# Altium schematic sheet motorBoardSCH.SchDoc
size A3
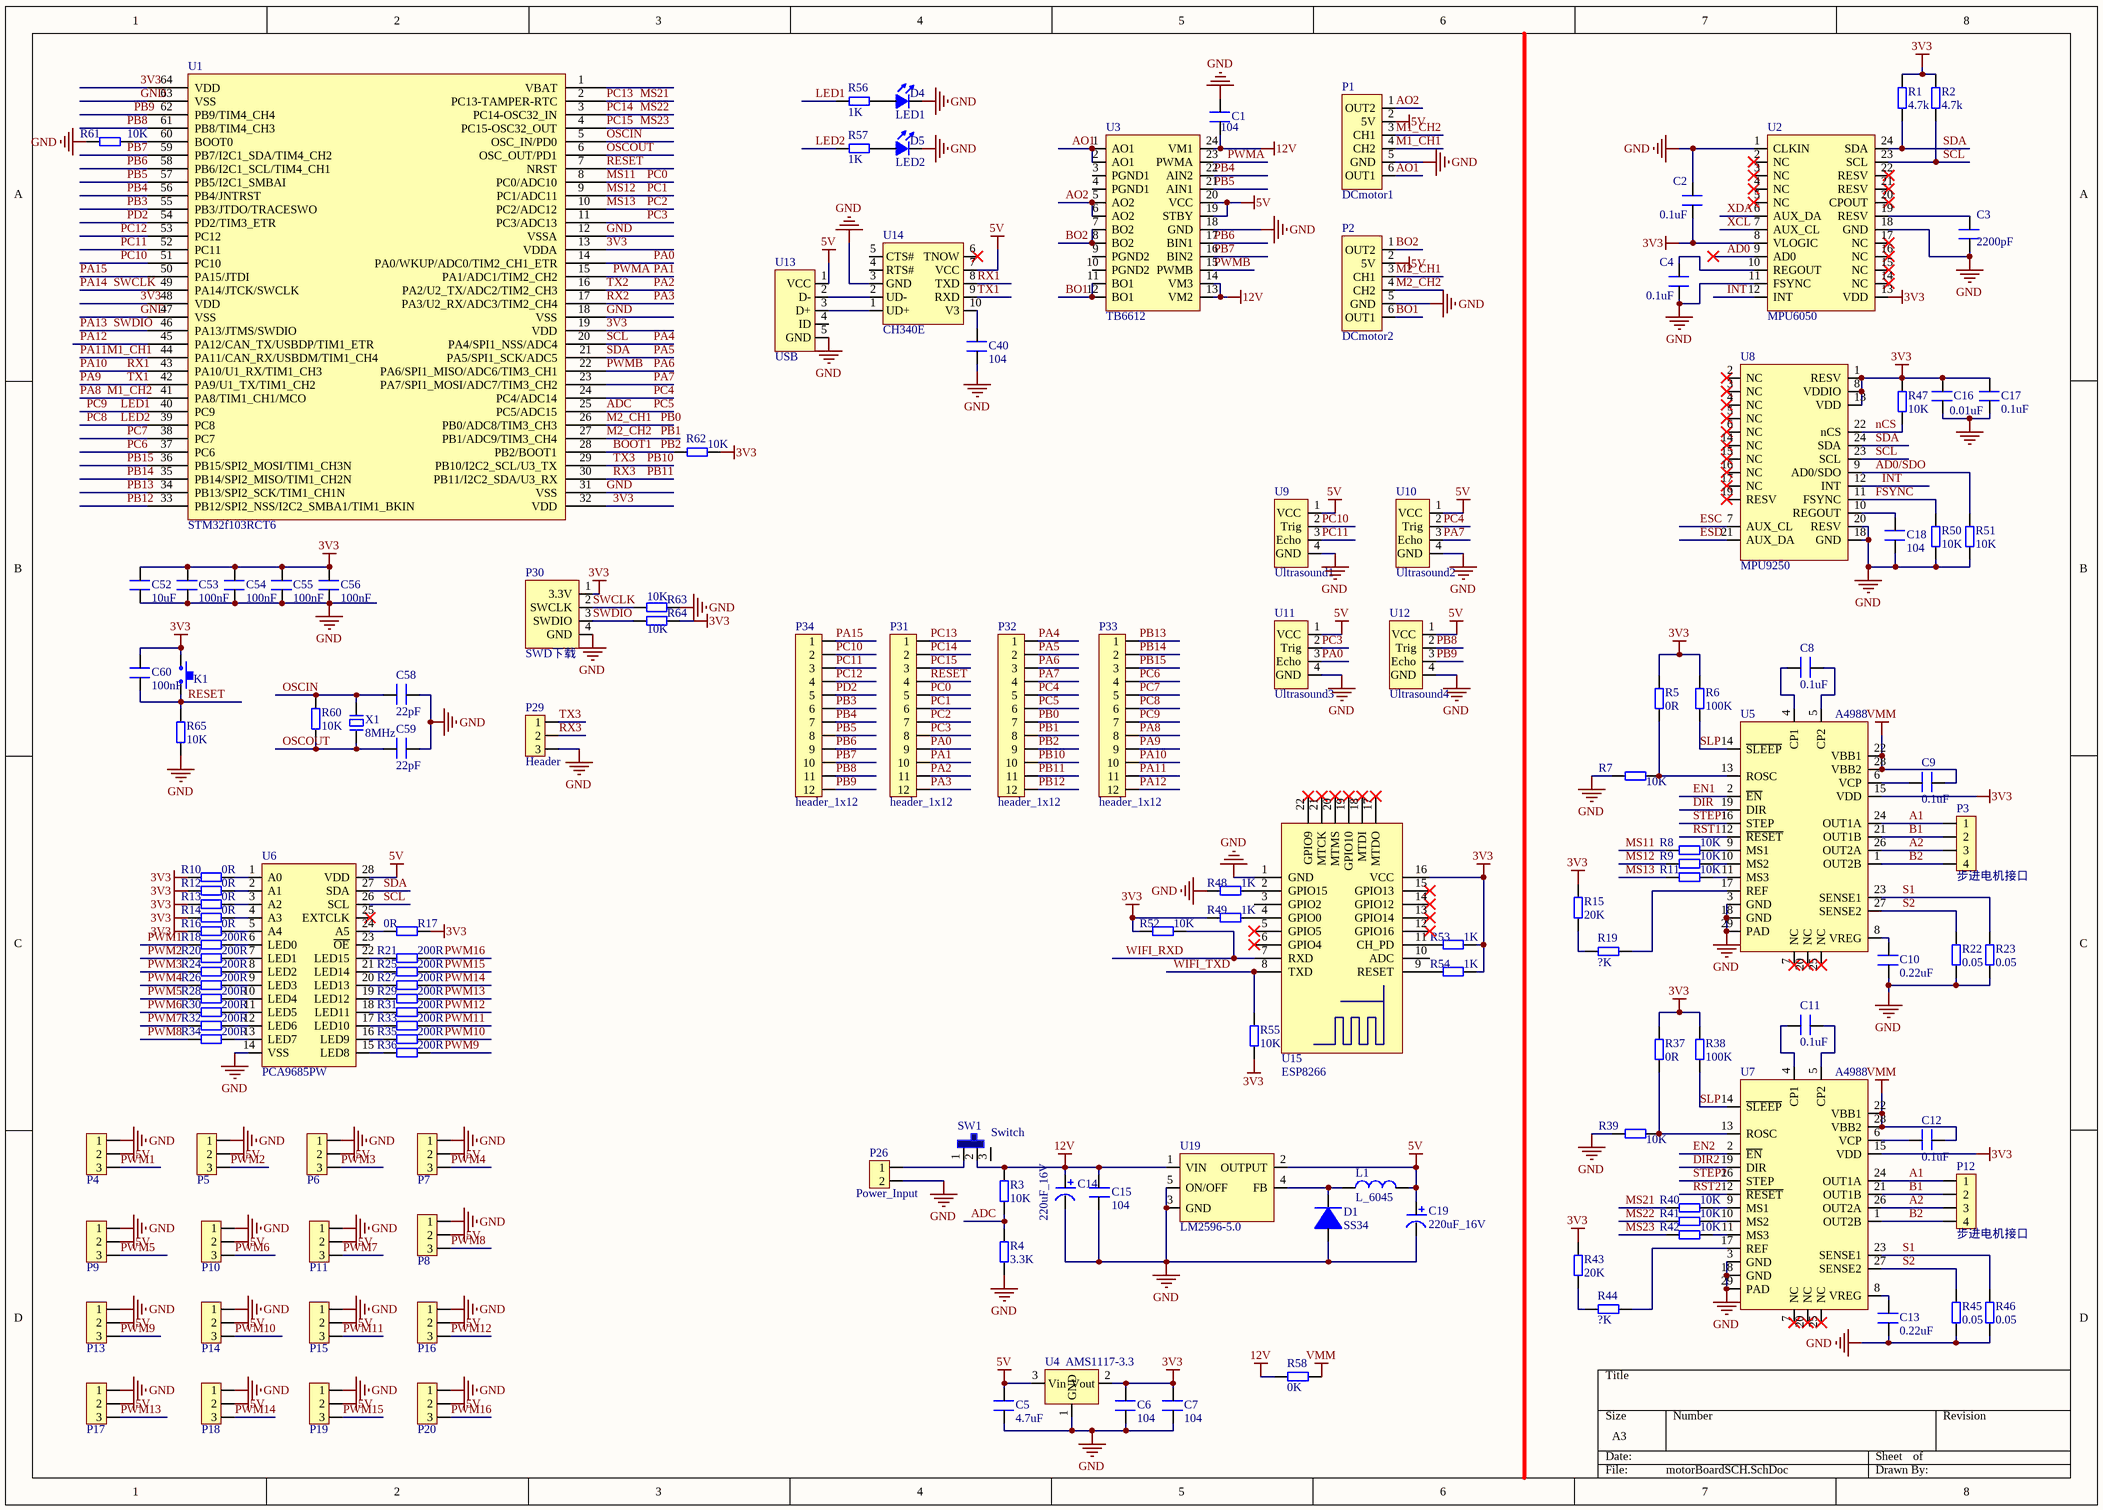
[diagram p0: motorBoardSCH.SchDoc]

## Parts
C1  104  [C 0603]
C2  0.1uF  [C 0603]
C3  2200pF  [C 0603]
C4  0.1uF  [C 0603]
C5  4.7uF  [C 0603]
C6  104  [C 0603]
C7  104  [C 0603]
C8  0.1uF  [C 0603]
C9  0.1uF  [C 0603]
C10  0.22uF  [C 0603]
C11  0.1uF  [C 0603]
C12  0.1uF  [C 0603]
C13  0.22uF  [C 0603]
C14  220uF_16V  [CM D(6.3*7.7)]
C15  104  [C 0603]
C16  0.01uF  [C 0603]
C17  0.1uF  [C 0603]
C18  104  [C 0603]
C19  220uF_16V  [CM D(6.3*7.7)]
C40  104  [C 0603]
C52  10uF  [C 0603]
C53  100nF  [C 0603]
C54  100nF  [C 0603]
C55  100nF  [C 0603]
C56  100nF  [C 0603]
C58  22pF  [C 0603]
C59  22pF  [C 0603]
C60  100nF  [C 0603]
D1  SS34  [SMA]
D4  LED1  [LED 0603R]
D5  LED2  [LED 0603R]
K1  key  [TSW SMD-3*6*4.3]  (value not drawn)
L1  L_6045  [NR6045]
P1  DCmotor1  [XH2.54-WI-6P]
P2  DCmotor2  [XH2.54-WI-6P]
P3  步进电机接口  [XH2.54-WI-4P]
P4  Head_1x3  [HDR2.54-LI-3P]  (value not drawn)
P5  Head_1x3  [HDR2.54-LI-3P]  (value not drawn)
P6  Head_1x3  [HDR2.54-LI-3P]  (value not drawn)
P7  Head_1x3  [HDR2.54-LI-3P]  (value not drawn)
P8  Head_1x3  [HDR2.54-LI-3P]  (value not drawn)
P9  Head_1x3  [HDR2.54-LI-3P]  (value not drawn)
P10  Head_1x3  [HDR2.54-LI-3P]  (value not drawn)
P11  Head_1x3  [HDR2.54-LI-3P]  (value not drawn)
P12  步进电机接口  [XH2.54-WI-4P]
P13  Head_1x3  [HDR2.54-LI-3P]  (value not drawn)
P14  Head_1x3  [HDR2.54-LI-3P]  (value not drawn)
P15  Head_1x3  [HDR2.54-LI-3P]  (value not drawn)
P16  Head_1x3  [HDR2.54-LI-3P]  (value not drawn)
P17  Head_1x3  [HDR2.54-LI-3P]  (value not drawn)
P18  Head_1x3  [HDR2.54-LI-3P]  (value not drawn)
P19  Head_1x3  [HDR2.54-LI-3P]  (value not drawn)
P20  Head_1x3  [HDR2.54-LI-3P]  (value not drawn)
P26  Power_Input  [XH2.54-WI-2P]
P29  Header  [HDR2.54-LI-3P]
P30  SWD下载  [HDR2.54-WI-4P]
P31  header_1x12  [HDR2.54-LI-12P]
P32  header_1x12  [HDR2.54-LI-12P]
P33  header_1x12  [HDR2.54-LI-12P]
P34  header_1x12  [HDR2.54-LI-12P]
R1  4.7k  [0603R]
R2  4.7k  [0603R]
R3  10K  [0603R]
R4  3.3K  [0603R]
R5  0R  [0603R]
R6  100K  [0603R]
R7  10K  [0603R]
R8  10K  [0603R]
R9  10K  [0603R]
R10  0R  [0603R]
R11  10K  [0603R]
R12  0R  [0603R]
R13  0R  [0603R]
R14  0R  [0603R]
R15  20K  [0603R]
R16  0R  [0603R]
R17  0R  [0603R]
R18  200R  [0603R]
R19  ?K  [0603R]
R20  200R  [0603R]
R21  200R  [0603R]
R22  0.05  [0603R]
R23  0.05  [0603R]
R24  200R  [0603R]
R25  200R  [0603R]
R26  200R  [0603R]
R27  200R  [0603R]
R28  200R  [0603R]
R29  200R  [0603R]
R30  200R  [0603R]
R31  200R  [0603R]
R32  200R  [0603R]
R33  200R  [0603R]
R34  200R  [0603R]
R35  200R  [0603R]
R36  200R  [0603R]
R37  0R  [0603R]
R38  100K  [0603R]
R39  10K  [0603R]
R40  10K  [0603R]
R41  10K  [0603R]
R42  10K  [0603R]
R43  20K  [0603R]
R44  ?K  [0603R]
R45  0.05  [0603R]
R46  0.05  [0603R]
R47  10K  [0603R]
R48  1K  [0603R]
R49  1K  [0603R]
R50  10K  [0603R]
R51  10K  [0603R]
R52  10K  [0603R]
R53  1K  [0603R]
R54  1K  [0603R]
R55  10K  [0603R]
R56  1K  [0603R]
R57  1K  [0603R]
R58  0K  [0603R]
R60  10K  [0603R]
R61  10K  [0603R]
R62  10K  [0603R]
R63  10K  [0603R]
R64  10K  [0603R]
R65  10K  [0603R]
SW1  Switch  [SS12D10]
U1  STM32f103RCT6  [LQFP_64]
U2  MPU6050  [QFN24 4x4]
U3  TB6612  [SSOP24]
U4  AMS1117-3.3  [SOT-223]
U5  A4988  [QFN28 5x5]
U6  PCA9685PW  [TSSOP28]
U7  A4988  [QFN28 5x5]
U8  MPU9250  [QFN24_3x3]
U9  Ultrasound1  [超声波模块]
U10  Ultrasound2  [超声波模块]
U11  Ultrasound3  [超声波模块]
U12  Ultrasound4  [超声波模块]
U13  USB  [USB-MICRO_D]
U14  CH340E  [CH340E]
U15  ESP8266  [ESP8266]
U19  LM2596-5.0  [TO263-5A]
X1  8MHz  [OSC HC-49SMD]

## Nets
3V3: C2.2 C6.1 C7.1 C16.1 C17.1 C52.1 C53.1 C54.1 C55.1 C56.1 C60.1 K1.1 P30.1(3.3V) R1.2 R2.2 R5.2 R6.2 R10.1 R12.1 R13.1 R14.1 R15.1 R16.1 R17.1 R37.2 R38.2 R43.1 R47.2 R49.1 R52.1 R53.2 R54.2 R55.1 R62.1 R64.1 U1.13(VDDA) U1.19(VDD) U1.32(VDD) U1.48(VDD) U1.64(VDD) U2.8(VLOGIC) U2.13(VDD) U4.2(Vout) U5.15(VDD) U7.15(VDD) U8.1(RESV) U8.8(VDDIO) U8.13(VDD) U15.16(VCC)
5V: C5.1 C19.1 L1.2 P1.2(5V) P2.2(5V) P4.2 P5.2 P6.2 P7.2 P8.2 P9.2 P10.2 P11.2 P13.2 P14.2 P15.2 P16.2 P17.2 P18.2 P19.2 P20.2 U3.19(STBY) U3.20(VCC) U4.3(Vin) U6.28(VDD) U9.1(VCC) U10.1(VCC) U11.1(VCC) U12.1(VCC) U13.1(VCC) U14.7(VCC) U19.2(OUTPUT)
12V: C1.2 C14.1 C15.2 R3.2 R58.2 SW1.2 U3.13(VM2) U3.14(VM3) U3.24(VM1) U19.1(VIN)
GND: C1.1 C2.1 C3.2 C4.2 C5.2 C6.2 C7.2 C10.2 C13.2 C14.2 C15.1 C16.2 C17.2 C18.2 C19.2 C40.2 C52.2 C53.2 C54.2 C55.2 C56.2 C58.1 C59.1 D1.1 D4.2 D5.2 P1.5(GND) P2.5(GND) P4.1 P5.1 P6.1 P7.1 P8.1 P9.1 P10.1 P11.1 P13.1 P14.1 P15.1 P16.1 P17.1 P18.1 P19.1 P20.1 P26.2 P29.3 P30.4(GND) R4.1 R7.2 R22.2 R23.2 R39.2 R45.2 R46.2 R48.1 R50.1 R51.1 R61.2 R63.1 R65.1 U1.12(VSSA) U1.18(VSS) U1.31(VSS) U1.47(VSS) U1.63(VSS) U2.1(CLKIN) U2.11(FSYNC) U2.18(GND) U3.18(GND) U4.1(GND) U5.3(GND) U5.18(GND) U5.29(PAD) U6.14(VSS) U7.3(GND) U7.18(GND) U7.29(PAD) U8.18(GND) U8.20(RESV) U9.4(GND) U10.4(GND) U11.4(GND) U12.4(GND) U13.5(GND) U14.3(GND) U15.1(GND) U19.3(GND) U19.5(ON/OFF)
VMM: C9.1 C12.1 R58.1 U5.22(VBB1) U5.28(VBB2) U7.22(VBB1) U7.28(VBB2)
A1: P3.1 P12.1 U5.24(OUT1A) U7.24(OUT1A)
A2: P3.3 P12.3 U5.26(OUT2A) U7.26(OUT2A)
AD0: U2.9(AD0)
AD0/SDO: R51.2 U8.9(AD0/SDO)
ADC: P32.6 R3.1 R4.2 U1.25(PC5/ADC15)  [also labelled PC5]
AO1: P1.6(OUT1) U3.1(AO1) U3.2(AO1)
AO2: P1.1(OUT2) U3.5(AO2) U3.6(AO2)
B1: P3.2 P12.2 U5.21(OUT1B) U7.21(OUT1B)
B2: P3.4 P12.4 U5.1(OUT2B) U7.1(OUT2B)
BO1: P2.6(OUT1) U3.11(BO1) U3.12(BO1)
BO2: P2.1(OUT2) U3.7(BO2) U3.8(BO2)
BOOT1: P32.9 R62.2 U1.28(PB2/BOOT1)  [also labelled PB2]
DIR: U5.19(DIR)
DIR2: U7.19(DIR)
EN1: U5.2(~{EN})
EN2: U7.2(~{EN})
ESC: U8.7(AUX_CL)
ESD: U8.21(AUX_DA)
FSYNC: R50.2 U8.11(FSYNC)
INT: U2.12(INT) U8.12(INT)
LED1: P33.7 R56.1 U1.40(PC9)  [also labelled PC9]
LED2: P33.6 R57.1 U1.39(PC8)  [also labelled PC8]
M1_CH1: P1.4(CH2) P33.11 U1.44(PA11/CAN_RX/USBDM/TIM1_CH4)  [also labelled PA11]
M1_CH2: P1.3(CH1) P33.8 U1.41(PA8/TIM1_CH1/MCO)  [also labelled PA8]
M2_CH1: P2.3(CH1) P32.7 U1.26(PB0/ADC8/TIM3_CH3)  [also labelled PB0]
M2_CH2: P2.4(CH2) P32.8 U1.27(PB1/ADC9/TIM3_CH4)  [also labelled PB1]
MS11: P31.5 R8.2 U1.8(PC0/ADC10)  [also labelled PC0]
MS12: P31.6 R9.2 U1.9(PC1/ADC11)  [also labelled PC1]
MS13: P31.7 R11.2 U1.10(PC2/ADC12)  [also labelled PC2]
MS21: P31.1 R40.2 U1.2(PC13-TAMPER-RTC)  [also labelled PC13]
MS22: P31.2 R41.2 U1.3(PC14-OSC32_IN)  [also labelled PC14]
MS23: P31.3 R42.2 U1.4(PC15-OSC32_OUT)  [also labelled PC15]
nCS: R47.1 U8.22(nCS)
OSCIN: C58.2 R60.2 U1.5(OSC_IN/PD0) X1.2
OSCOUT: C59.2 R60.1 U1.6(OSC_OUT/PD1) X1.1
PA0: P31.9 U1.14(PA0/WKUP/ADC0/TIM2_CH1_ETR) U11.3(Echo)
PA1: P31.10 U1.15(PA1/ADC1/TIM2_CH2) U3.23(PWMA)  [also labelled PWMA]
PA2: P31.11 U1.16(PA2/U2_TX/ADC2/TIM2_CH3)  [also labelled TX2]
PA3: P31.12 U1.17(PA3/U2_RX/ADC3/TIM2_CH4)  [also labelled RX2]
PA4: P32.1 R2.1 U1.20(PA4/SPI1_NSS/ADC4) U2.23(SCL) U6.26(SCL) U8.23(SCL)  [also labelled SCL]
PA5: P32.2 R1.1 U1.21(PA5/SPI1_SCK/ADC5) U2.24(SDA) U6.27(SDA) U8.24(SDA)  [also labelled SDA]
PA6: P32.3 U1.22(PA6/SPI1_MISO/ADC6/TIM3_CH1) U3.15(PWMB)  [also labelled PWMB]
PA7: P32.4 U1.23(PA7/SPI1_MOSI/ADC7/TIM3_CH2) U10.3(Echo)
PA9: P33.9 U1.42(PA9/U1_TX/TIM1_CH2) U14.9(RXD)  [also labelled TX1]
PA10: P33.10 U1.43(PA10/U1_RX/TIM1_CH3) U14.8(TXD)  [also labelled RX1]
PA12: P33.12 U1.45(PA12/CAN_TX/USBDP/TIM1_ETR)
PA13: P30.3(SWDIO) R64.2 U1.46(PA13/JTMS/SWDIO)  [also labelled SWDIO]
PA14: P30.2(SWCLK) R63.2 U1.49(PA14/JTCK/SWCLK)  [also labelled SWCLK]
PA15: P34.1 U1.50(PA15/JTDI)
PB3: P34.6 U1.55(PB3/JTDO/TRACESWO)
PB4: P34.7 U1.56(PB4/JNTRST) U3.22(AIN2)
PB5: P34.8 U1.57(PB5/I2C1_SMBAI) U3.21(AIN1)
PB6: P34.9 U1.58(PB6/I2C1_SCL/TIM4_CH1) U3.17(BIN1)
PB7: P34.10 U1.59(PB7/I2C1_SDA/TIM4_CH2) U3.16(BIN2)
PB8: P34.11 U1.61(PB8/TIM4_CH3) U12.2(Trig)
PB9: P34.12 U1.62(PB9/TIM4_CH4) U12.3(Echo)
PB10: P29.1 P32.10 U1.29(PB10/I2C2_SCL/U3_TX)  [also labelled TX3]
PB11: P29.2 P32.11 U1.30(PB11/I2C2_SDA/U3_RX)  [also labelled RX3]
PB12: P32.12 U1.33(PB12/SPI2_NSS/I2C2_SMBA1/TIM1_BKIN)
PB13: P33.1 U1.34(PB13/SPI2_SCK/TIM1_CH1N)
PB14: P33.2 U1.35(PB14/SPI2_MISO/TIM1_CH2N)
PB15: P33.3 U1.36(PB15/SPI2_MOSI/TIM1_CH3N)
PC3: P31.8 U1.11(PC3/ADC13) U11.2(Trig)
PC4: P32.5 U1.24(PC4/ADC14) U10.2(Trig)
PC6: P33.4 U1.37(PC6)
PC7: P33.5 U1.38(PC7)
PC10: P34.2 U1.51(PC10) U9.2(Trig)
PC11: P34.3 U1.52(PC11) U9.3(Echo)
PC12: P34.4 U1.53(PC12)
PD2: P34.5 U1.54(PD2/TIM3_ETR)
PWM1: P4.3 R18.1
PWM2: P5.3 R20.1
PWM3: P6.3 R24.1
PWM4: P7.3 R26.1
PWM5: P9.3 R28.1
PWM6: P10.3 R30.1
PWM7: P11.3 R32.1
PWM8: P8.3 R34.1
PWM9: P13.3 R36.1
PWM10: P14.3 R35.1
PWM11: P15.3 R33.1
PWM12: P16.3 R31.1
PWM13: P17.3 R29.1
PWM14: P18.3 R27.1
PWM15: P19.3 R25.1
PWM16: P20.3 R21.1
RESET: C60.2 K1.2 P31.4 R65.2 U1.7(NRST)
RST1: U5.12(~{RESET})
RST2: U7.12(~{RESET})
S1: R23.1 R46.1 U5.23(SENSE1) U7.23(SENSE1)
S2: R22.1 R45.1 U5.27(SENSE2) U7.27(SENSE2)
SLP: R6.1 R38.1 U5.14(~{SLEEP}) U7.14(~{SLEEP})
STEP1: U5.16(STEP)
STEP2: U7.16(STEP)
WIFI_RXD: R52.2 U15.7(RXD)
WIFI_TXD: R55.2 U15.8(TXD)
XCL: U2.7(AUX_CL)
XDA: U2.6(AUX_DA)
NetC3_1: C3.1 U2.19(RESV)
NetC4_1: C4.1 U2.10(REGOUT)
NetC8_1: C8.1 U5.5(CP2)
NetC8_2: C8.2 U5.4(CP1)
NetC9_2: C9.2 U5.6(VCP)
NetC10_1: C10.1 U5.8(VREG)
NetC11_1: C11.1 U7.5(CP2)
NetC11_2: C11.2 U7.4(CP1)
NetC12_2: C12.2 U7.6(VCP)
NetC13_1: C13.1 U7.8(VREG)
NetC18_1: C18.1 U8.10(REGOUT)
NetC40_1: C40.1 U14.10(V3)
NetD1_2: D1.2 L1.1 U19.4(FB)
NetD4_1: D4.1 R56.2
NetD5_1: D5.1 R57.2
NetP26_1: P26.1 SW1.1
NetR5_1: R5.1 R7.1 U5.13(ROSC)
NetR8_1: R8.1 U5.9(MS1)
NetR9_1: R9.1 U5.10(MS2)
NetR10_2: R10.2 U6.1(A0)
NetR11_1: R11.1 U5.11(MS3)
NetR12_2: R12.2 U6.2(A1)
NetR13_2: R13.2 U6.3(A2)
NetR14_2: R14.2 U6.4(A3)
NetR15_2: R15.2 R19.1
NetR16_2: R16.2 U6.5(A4)
NetR17_2: R17.2 U6.24(A5)
NetR18_2: R18.2 U6.6(LED0)
NetR19_2: R19.2 U5.17(REF)
NetR20_2: R20.2 U6.7(LED1)
NetR21_2: R21.2 U6.22(LED15)
NetR24_2: R24.2 U6.8(LED2)
NetR25_2: R25.2 U6.21(LED14)
NetR26_2: R26.2 U6.9(LED3)
NetR27_2: R27.2 U6.20(LED13)
NetR28_2: R28.2 U6.10(LED4)
NetR29_2: R29.2 U6.19(LED12)
NetR30_2: R30.2 U6.11(LED5)
NetR31_2: R31.2 U6.18(LED11)
NetR32_2: R32.2 U6.12(LED6)
NetR33_2: R33.2 U6.17(LED10)
NetR34_2: R34.2 U6.13(LED7)
NetR35_2: R35.2 U6.16(LED9)
NetR36_2: R36.2 U6.15(LED8)
NetR37_1: R37.1 R39.1 U7.13(ROSC)
NetR40_1: R40.1 U7.9(MS1)
NetR41_1: R41.1 U7.10(MS2)
NetR42_1: R42.1 U7.11(MS3)
NetR43_2: R43.2 R44.1
NetR44_2: R44.2 U7.17(REF)
NetR48_2: R48.2 U15.2(GPIO15)
NetR49_2: R49.2 U15.4(GPIO0)
NetR53_1: R53.1 U15.11(CH_PD)
NetR54_1: R54.1 U15.9(RESET)
NetR61_1: R61.1 U1.60(BOOT0)
NetU13_2: U13.2(D-) U14.2(UD-)
NetU13_3: U13.3(D+) U14.1(UD+)

Not connected (* = marked no-connect by the designer): SW1 3; U1 1(VBAT); U2 2(NC)* 3(NC)* 4(NC)* 5(NC)* 14(NC)* 15(NC)* 16(NC)* 17(NC)* 20(CPOUT)* 21(RESV)* 22(RESV)*; U3 3(PGND1) 4(PGND1) 9(PGND2) 10(PGND2); U5 7(NC)* 20(NC)* 25(NC)*; U6 23(~{OE}) 25(EXTCLK)*; U7 7(NC)* 20(NC)* 25(NC)*; U8 2(NC)* 3(NC)* 4(NC)* 5(NC)* 6(NC)* 14(NC)* 15(NC)* 16(NC)* 17(NC)* 19(RESV)*; U13 4(ID); U14 4(RTS#) 5(CTS#) 6(TNOW)*; U15 3(GPIO2) 5(GPIO5)* 6(GPIO4)* 10(ADC) 12(GPIO16)* 13(GPIO14)* 14(GPIO12)* 15(GPIO13)* 17(MTDO)* 18(MTDI)* 19(GPIO10)* 20(MTMS)* 21(MTCK)* 22(GPIO9)*

## Library data of the parts
C1-C13 C15-C18 C40 C52-C56 C58-C60 = C_0603
C14 C19 = CAP_220uF_16V
D4 D5 = LED
P1 P2 = DCMotor
P3 P12 = header_1x4
P26 = header_1x2
P29 = header_1x3
P30 = SWD
R1-R58 R60-R65 = R_0603
SW1 = SS12D10
U3 = TB6612FNG
U9-U12 = Ultrasound
U13 = MicroUSB_D
X1 = XTAL_8MHz